# Altium schematic sheet SPIbus.SchDoc
size A4
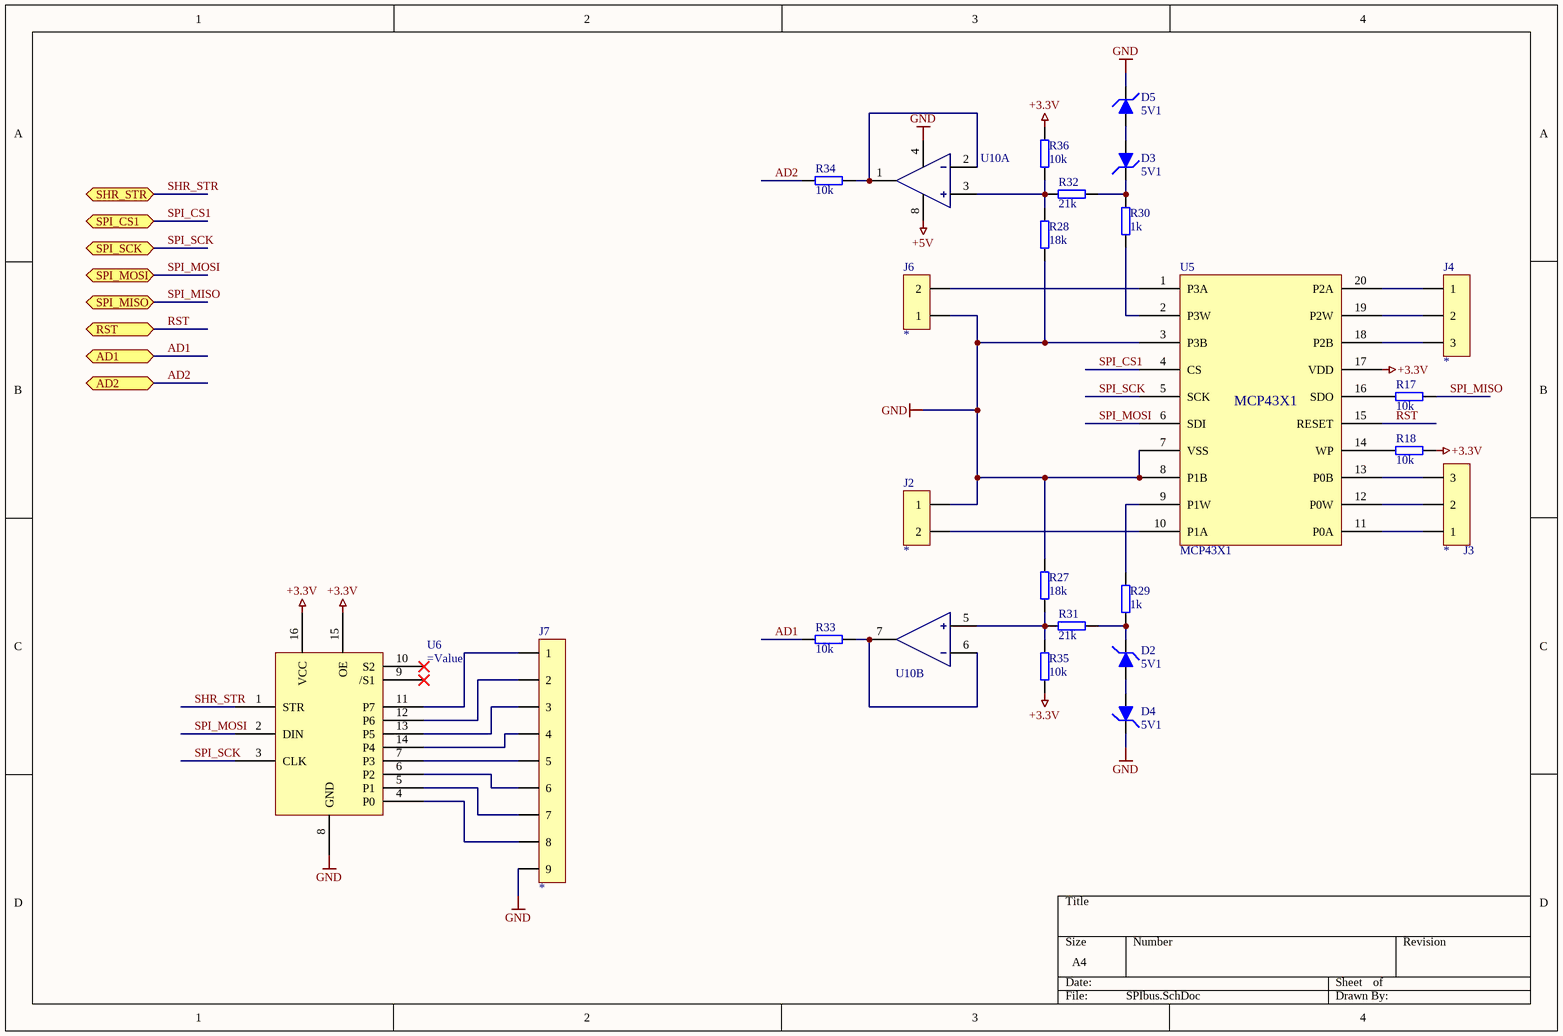
[diagram p0: SPIbus.SchDoc]

## Parts
D2  U_Z: 5V1  [SOD-232F]
D3  U_Z: 5V1  [SOD-232F]
D4  U_Z: 5V1  [SOD-232F]
D5  U_Z: 5V1  [SOD-232F]
J2  *  [SIL2]
J3  *  [SIL3]
J4  *  [SIL3]
J6  *  [SIL2]
J7  *  [SIL9]
R17  10k  [RES 0805]
R18  10k  [RES 0805]
R27  18k  [RES 0805]
R28  18k  [RES 0805]
R29  1k  [RES 0805]
R30  1k  [RES 0805]
R31  21k  [RES 0805]
R32  21k  [RES 0805]
R33  10k  [RES 0805]
R34  10k  [RES 0805]
R35  10k  [RES 0805]
R36  10k  [RES 0805]
U5  MCP43X1  [TSSOP20]
U6  (no value)  [SO16N]
U10  TL082  [SO8]  (value not drawn)  (parts A,B of 2)

## Ports
AD1 (bidir), AD2 (bidir), RST (bidir), SHR_STR (bidir), SPI_CS1 (bidir), SPI_MISO (bidir), SPI_MOSI (bidir), SPI_SCK (bidir)

## Nets
+3.3V: R18.2 R35.2 R36.2 U5.17(VDD) U6.15(OE) U6.16(VCC)
+5V: U10.8(VCC)
GND: D4.2(K) D5.2(K) J2.1 J6.1 J7.9 R27.1 R28.1 U5.3(P3B) U5.7(VSS) U5.8(P1B) U6.8(GND) U10.4(GND)
AD1: R33.2 ; port AD1
AD2: R34.2 ; port AD2
RST: U5.15(RESET) ; port RST
SHR_STR: U6.1(STR) ; port SHR_STR
SPI_CS1: U5.4(CS) ; port SPI_CS1
SPI_MISO: R17.2 ; port SPI_MISO
SPI_MOSI: U5.6(SDI) U6.2(DIN) ; port SPI_MOSI
SPI_SCK: U5.5(SCK) U6.3(CLK) ; port SPI_SCK
NetD2_1: D2.1(A) D4.1(A)
NetD2_2: D2.2(K) R29.1 R31.2
NetD3_1: D3.1(A) D5.1(A)
NetD3_2: D3.2(K) R30.1 R32.2
NetJ2_2: J2.2 U5.10(P1A)
NetJ3_1: J3.1 U5.11(P0A)
NetJ3_2: J3.2 U5.12(P0W)
NetJ3_3: J3.3 U5.13(P0B)
NetJ4_1: J4.1 U5.20(P2A)
NetJ4_2: J4.2 U5.19(P2W)
NetJ4_3: J4.3 U5.18(P2B)
NetJ6_2: J6.2 U5.1(P3A)
NetJ7_1: J7.1 U6.11(P7)
NetJ7_2: J7.2 U6.12(P6)
NetJ7_3: J7.3 U6.13(P5)
NetJ7_4: J7.4 U6.14(P4)
NetJ7_5: J7.5 U6.7(P3)
NetJ7_6: J7.6 U6.6(P2)
NetJ7_7: J7.7 U6.5(P1)
NetJ7_8: J7.8 U6.4(P0)
NetR17_1: R17.1 U5.16(SDO)
NetR18_1: R18.1 U5.14(WP)
NetR27_2: R27.2 R31.1 R35.1 U10.5(+)
NetR28_2: R28.2 R32.1 R36.1 U10.3(+)
NetR29_2: R29.2 U5.9(P1W)
NetR30_2: R30.2 U5.2(P3W)
NetR33_1: R33.1 U10.6(-) U10.7(OUT)
NetR34_1: R34.1 U10.1(OUT) U10.2(-)

Not connected (* = marked no-connect by the designer): U6 9(/S1)* 10(S2)*

## Library data of the parts
D2-D5 = ZENER: Zener Diode
J2 J6 = HEADER2: 2 PIN HEADER; REFERENCE ID: *; DISTRIBUTOR: *; VALUE: *
J3 J4 = HEADER3: 3 PIN HEADER; Value: *
J7 = HEADER9: 9 PIN HEADER; Value: *
R17 R18 R27-R36 = RES: RESISTOR; REFERENCE ID: *; DISTRIBUTOR: *
  R17 R18 R33-R36: VALUE: 10k
  R27 R28: VALUE: 18k
  R29 R30: VALUE: 1k
  R31 R32: VALUE: 21k
U5 = MCP43X1: SPI INTERFACE QUAD DIGITAL POTENTIOMETERS; Name: MCP43X1; Datasheet: http://ww1.microchip.com/downloads/en/DeviceDoc/22242A.pdf
U6 = 4094: 8 BIT SHIFT REGISTER; Name: 4094; Datasheet: https://assets.nexperia.com/documents/data-sheet/74HC_HCT4094.pdf
U10 = TL082: OPAMP, SO8; Name: TL082; Datasheet: http://www.ti.com/lit/ds/symlink/tl082.pdf